# EAGLE design TMC2660-test-with-grbl (EAGLE 7.5.0)

## Sheet 1 of 4
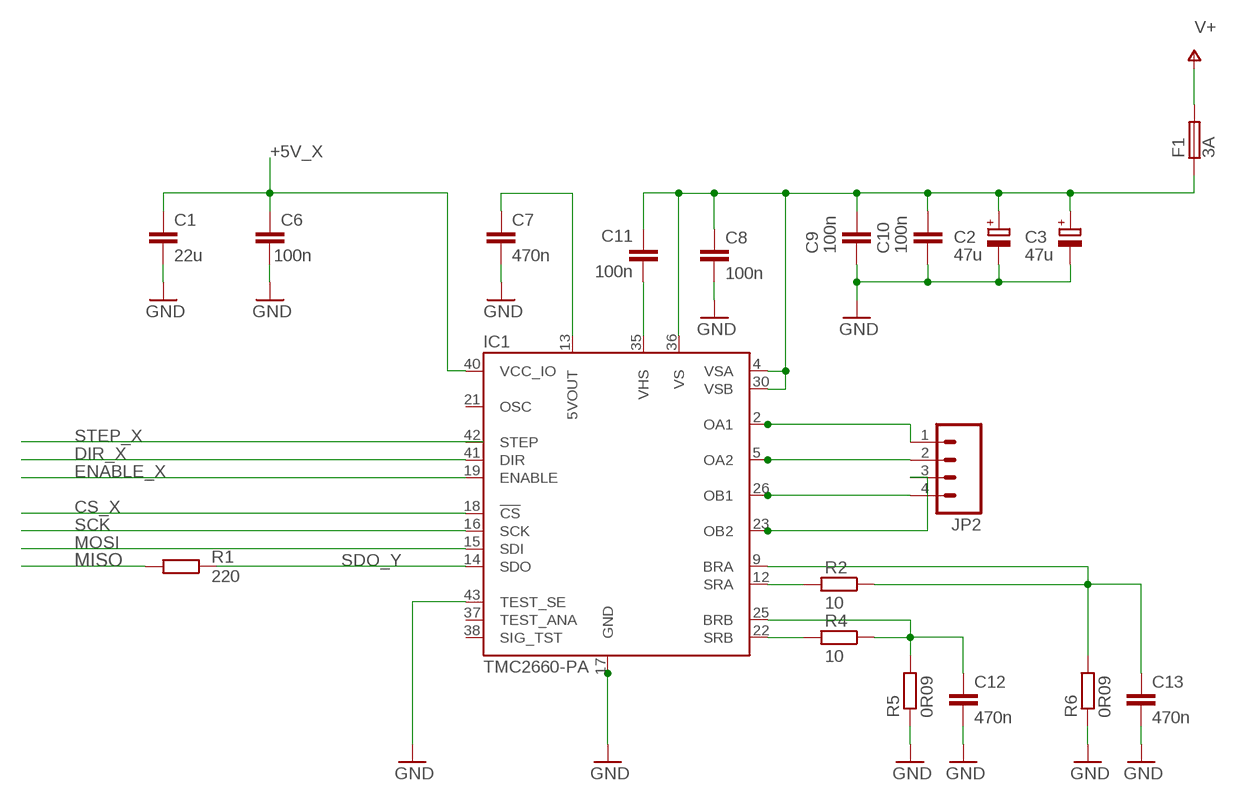
[diagram p0: schematic, sheet 1]

### Parts
C1  22u  C-EUC1206  [C1206]
C2  47u  CPOL-EUE5-8.5  [E5-8,5]
C3  47u  CPOL-EUE5-8.5  [E5-8,5]
C6  100n  C-EUC1206K  [C1206K]
C7  470n  C-0805W  [0805-WIDE]
C8  100n  C-EUC0603K  [C0603K]
C9  100n  C-EUC0603K  [C0603K]
C10  100n  C-EUC0603K  [C0603K]
C11  100n  C-EUC0603K  [C0603K]
C12  470n  C-0805W  [0805-WIDE]
C13  470n  C-0805W  [0805-WIDE]
F1  3A  AF2-FUSE_AF  [AF2]
IC1  TMC2660-PA  [PQFP44]
JP2  M04SCREW  [SCREWTERMINAL-3.5MM-4]
R1  220  R-EU_R0603  [R0603]
R2  10  R-EU_R0603  [R0603]
R4  10  R-EU_R0603  [R0603]
R5  0R09  R-EU_R2512  [R2512]
R6  0R09  R-EU_R2512  [R2512]

### Nets
+5V_X: C1.1 C6.2 IC1.40(VCC_IO)
CS_X: IC1.18(!CS) ; also sheet 4
DIR_X: IC1.41(DIR) ; also sheet 4
ENABLE_X: IC1.19(ENABLE) ; also sheet 4
GND: C1.2 C2.- C3.- C6.1 C7.2 C8.2 C9.1 C10.1 C12.2 C13.2 IC1.17(GND) IC1.39(GND1) IC1.43(TEST_SE) IC1.44(GND2) R5.1 R6.1 ; also sheet 2,3,4
MISO: R1.2 ; also sheet 2,3,4
MOSI: IC1.15(SDI) ; also sheet 2,3,4
N$1: IC1.22(SRB) R4.2
N$2: C12.1 IC1.25(BRB) R4.1 R5.2
N$3: C13.1 IC1.9(BRA) R2.1 R6.2
N$4: IC1.12(SRA) R2.2
OA1: IC1.2(OA1) IC1.3(OA1_1) IC1.7(OA1_2) IC1.8(OA1_3) JP2.1
OA2: IC1.5(OA2) IC1.6(OA2_1) IC1.10(OA2_2) IC1.11(OA2_3) JP2.2
OB1: IC1.26(OB1) IC1.27(OB1_1) IC1.31(OB1_2) IC1.32(OB1_3) JP2.4
OB2: IC1.23(OB2) IC1.24(OB2_1) IC1.28(OB2_2) IC1.29(OB2_3) JP2.3
PWR_X: C2.+ C3.+ C8.1 C9.2 C10.2 C11.2 F1.P$1 IC1.4(VSA) IC1.30(VSB) IC1.36(VS)
SCK: IC1.16(SCK) ; also sheet 2,3,4
SDO_Y: IC1.14(SDO) R1.1
STEP_X: IC1.42(STEP) ; also sheet 4
V+: F1.P$2 ; also sheet 2,3
VHS: C11.1 IC1.35(VHS)
VREG: C7.1 IC1.13(5VOUT)
Unconnected: IC1.21(OSC) IC1.37(TEST_ANA) IC1.38(SIG_TST)

## Sheet 2 of 4
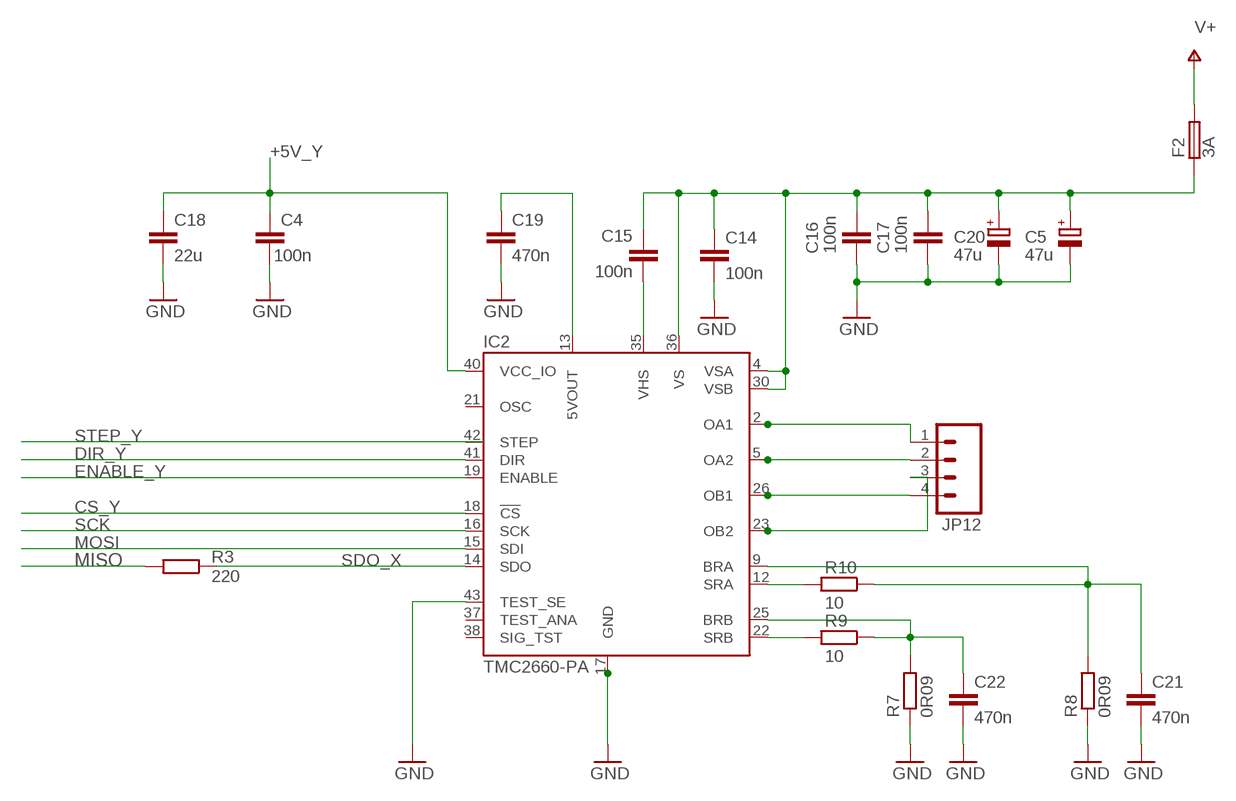
[diagram p1: schematic, sheet 2]

### Parts
C4  100n  C-EUC1206K  [C1206K]
C5  47u  CPOL-EUE5-8.5  [E5-8,5]
C14  100n  C-EUC0603K  [C0603K]
C15  100n  C-EUC0603K  [C0603K]
C16  100n  C-EUC0603K  [C0603K]
C17  100n  C-EUC0603K  [C0603K]
C18  22u  C-EUC1206  [C1206]
C19  470n  C-0805W  [0805-WIDE]
C20  47u  CPOL-EUE5-8.5  [E5-8,5]
C21  470n  C-0805W  [0805-WIDE]
C22  470n  C-0805W  [0805-WIDE]
F2  3A  AF2-FUSE_AF  [AF2]
IC2  TMC2660-PA  [PQFP44]
JP12  M04SCREW  [SCREWTERMINAL-3.5MM-4]
R3  220  R-EU_R0603  [R0603]
R7  0R09  R-EU_R2512  [R2512]
R8  0R09  R-EU_R2512  [R2512]
R9  10  R-EU_R0603  [R0603]
R10  10  R-EU_R0603  [R0603]

### Nets
+5V_Y: C4.2 C18.1 IC2.40(VCC_IO)
CS_Y: IC2.18(!CS) ; also sheet 4
DIR_Y: IC2.41(DIR) ; also sheet 4
ENABLE_Y: IC2.19(ENABLE) ; also sheet 4
GND: C4.1 C5.- C14.2 C16.1 C17.1 C18.2 C19.2 C20.- C21.2 C22.2 IC2.17(GND) IC2.39(GND1) IC2.43(TEST_SE) IC2.44(GND2) R7.1 R8.1 ; also sheet 1,3,4
MISO: R3.2 ; also sheet 1,3,4
MOSI: IC2.15(SDI) ; also sheet 1,3,4
N$5: C22.1 IC2.25(BRB) R7.2 R9.1
N$6: C21.1 IC2.9(BRA) R8.2 R10.1
N$7: IC2.22(SRB) R9.2
N$8: IC2.12(SRA) R10.2
OA3: IC2.2(OA1) IC2.3(OA1_1) IC2.7(OA1_2) IC2.8(OA1_3) JP12.1
OA4: IC2.5(OA2) IC2.6(OA2_1) IC2.10(OA2_2) IC2.11(OA2_3) JP12.2
OB3: IC2.23(OB2) IC2.24(OB2_1) IC2.28(OB2_2) IC2.29(OB2_3) JP12.3
OB4: IC2.26(OB1) IC2.27(OB1_1) IC2.31(OB1_2) IC2.32(OB1_3) JP12.4
PWR_Y: C5.+ C14.1 C15.2 C16.2 C17.2 C20.+ F2.P$1 IC2.4(VSA) IC2.30(VSB) IC2.36(VS)
SCK: IC2.16(SCK) ; also sheet 1,3,4
SDO_X: IC2.14(SDO) R3.1
STEP_Y: IC2.42(STEP) ; also sheet 4
V+: F2.P$2 ; also sheet 1,3
VHS1: C15.1 IC2.35(VHS)
VREG1: C19.1 IC2.13(5VOUT)
Unconnected: IC2.21(OSC) IC2.37(TEST_ANA) IC2.38(SIG_TST)

## Sheet 3 of 4
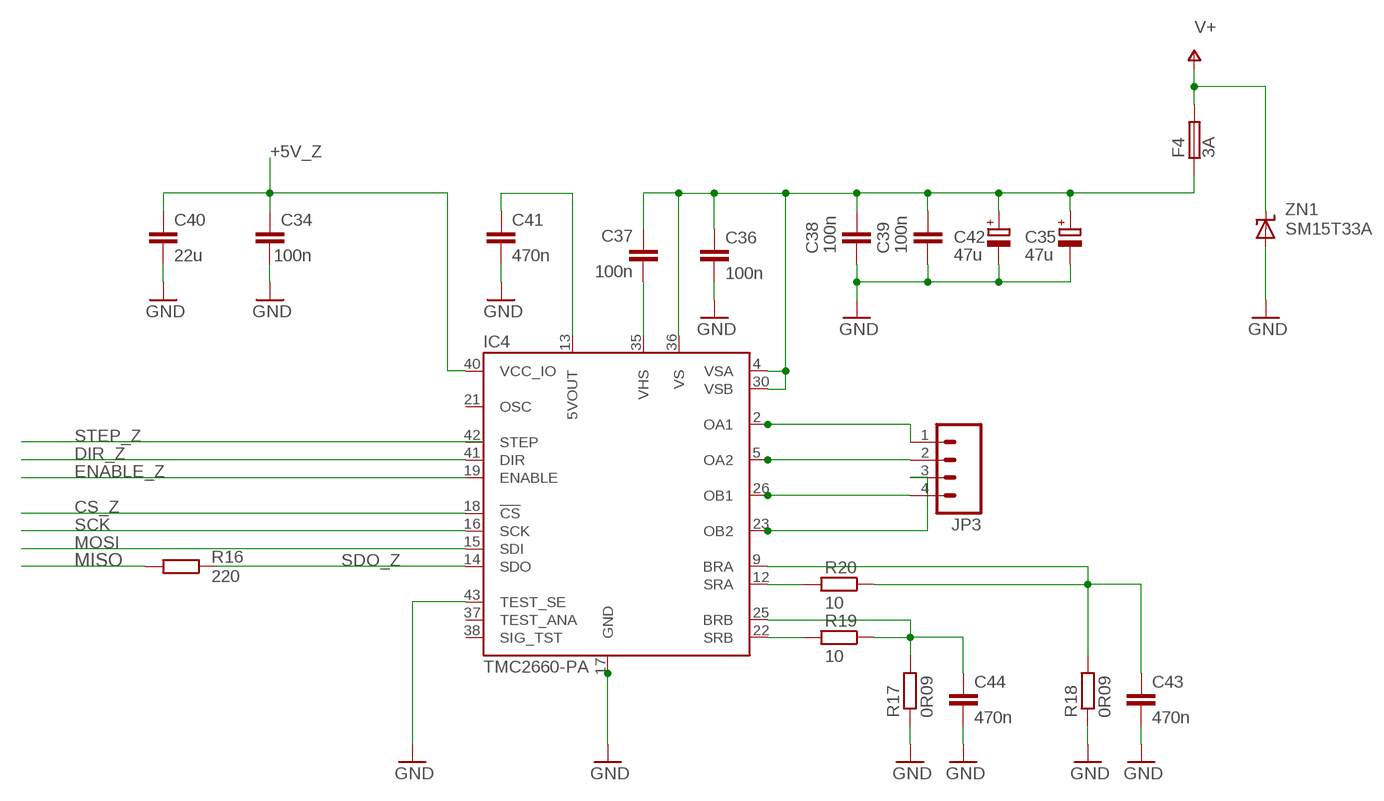
[diagram p2: schematic, sheet 3]

### Parts
C34  100n  C-EUC1206K  [C1206K]
C35  47u  CPOL-EUE5-8.5  [E5-8,5]
C36  100n  C-EUC0603K  [C0603K]
C37  100n  C-EUC0603K  [C0603K]
C38  100n  C-EUC0603K  [C0603K]
C39  100n  C-EUC0603K  [C0603K]
C40  22u  C-EUC1206  [C1206]
C41  470n  C-0805W  [0805-WIDE]
C42  47u  CPOL-EUE5-8.5  [E5-8,5]
C43  470n  C-0805W  [0805-WIDE]
C44  470n  C-0805W  [0805-WIDE]
F4  3A  AF2-FUSE_AF  [AF2]
IC4  TMC2660-PA  [PQFP44]
JP3  M04SCREW  [SCREWTERMINAL-3.5MM-4]
R16  220  R-EU_R0603  [R0603]
R17  0R09  R-EU_R2512  [R2512]
R18  0R09  R-EU_R2512  [R2512]
R19  10  R-EU_R0603  [R0603]
R20  10  R-EU_R0603  [R0603]
ZN1  SM15T33A  D-ZN_SMC  [SMC]

### Nets
+5V_Z: C34.2 C40.1 IC4.40(VCC_IO)
CS_Z: IC4.18(!CS) ; also sheet 4
DIR_Z: IC4.41(DIR) ; also sheet 4
ENABLE_Z: IC4.19(ENABLE) ; also sheet 4
GND: C34.1 C35.- C36.2 C38.1 C39.1 C40.2 C41.2 C42.- C43.2 C44.2 IC4.17(GND) IC4.39(GND1) IC4.43(TEST_SE) IC4.44(GND2) R17.1 R18.1 ZN1.P$2(A) ; also sheet 1,2,4
MISO: R16.2 ; also sheet 1,2,4
MOSI: IC4.15(SDI) ; also sheet 1,2,4
N$9: C44.1 IC4.25(BRB) R17.2 R19.1
N$10: C43.1 IC4.9(BRA) R18.2 R20.1
N$11: IC4.22(SRB) R19.2
N$12: IC4.12(SRA) R20.2
OA5: IC4.2(OA1) IC4.3(OA1_1) IC4.7(OA1_2) IC4.8(OA1_3) JP3.1
OA6: IC4.5(OA2) IC4.6(OA2_1) IC4.10(OA2_2) IC4.11(OA2_3) JP3.2
OB5: IC4.23(OB2) IC4.24(OB2_1) IC4.28(OB2_2) IC4.29(OB2_3) JP3.3
OB6: IC4.26(OB1) IC4.27(OB1_1) IC4.31(OB1_2) IC4.32(OB1_3) JP3.4
PWR_Z: C35.+ C36.1 C37.2 C38.2 C39.2 C42.+ F4.P$1 IC4.4(VSA) IC4.30(VSB) IC4.36(VS)
SCK: IC4.16(SCK) ; also sheet 1,2,4
SDO_Z: IC4.14(SDO) R16.1
STEP_Z: IC4.42(STEP) ; also sheet 4
V+: F4.P$2 ZN1.P$1(C) ; also sheet 1,2
VHS2: C37.1 IC4.35(VHS)
VREG2: C41.1 IC4.13(5VOUT)
Unconnected: IC4.21(OSC) IC4.37(TEST_ANA) IC4.38(SIG_TST)

## Sheet 4 of 4
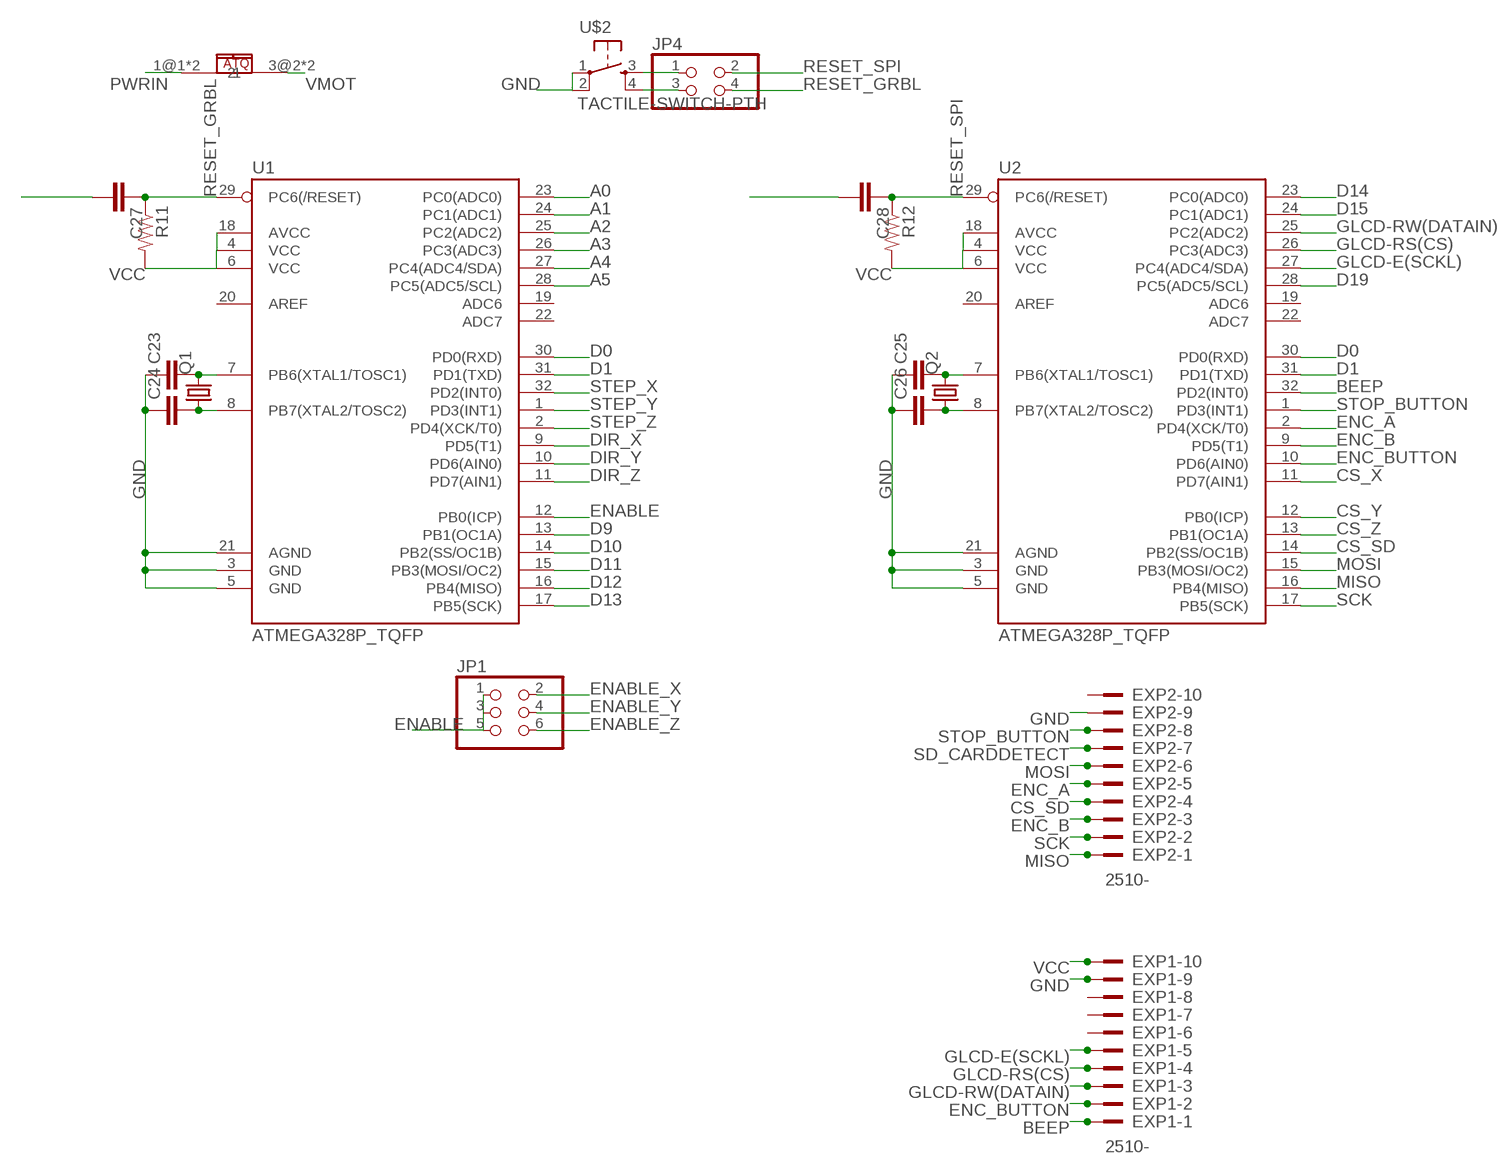
[diagram p3: schematic, sheet 4]

### Parts
C23  CAP1206  [1206]
C24  CAP1206  [1206]
C25  CAP1206  [1206]
C26  CAP1206  [1206]
C27  CAP1206  [1206]
C28  CAP1206  [1206]
EXP1  2510-  [PAK100/2500-10]
EXP2  2510-  [PAK100/2500-10]
JP1  PINHD-2X3  [2X03]
JP4  PINHD-2X2  [2X02]
Q1  CRYSTALHC49UP  [HC49UP]
Q2  CRYSTALHC49UP  [HC49UP]
R11  RESISTOR1206  [1206]
R12  RESISTOR1206  [1206]
U1  ATMEGA328P_TQFP  [TQFP32-08]
U2  ATMEGA328P_TQFP  [TQFP32-08]
U$2  TACTILE-SWITCH-PTH  [TAC-SWITCH-PTH]
U$6  CQ-121  [CQ121]

### Nets
A0: U1.23(PC0(ADC0))
A1: U1.24(PC1(ADC1))
A2: U1.25(PC2(ADC2))
A3: U1.26(PC3(ADC3))
A4: U1.27(PC4(ADC4/SDA))
A5: U1.28(PC5(ADC5/SCL))
BEEP: EXP1.1 U2.32(PD2(INT0))
CS_SD: EXP2.4 U2.14(PB2(SS/OC1B))
CS_X: U2.11(PD7(AIN1)) ; also sheet 1
CS_Y: U2.12(PB0(ICP)) ; also sheet 2
CS_Z: U2.13(PB1(OC1A)) ; also sheet 3
D0: U1.30(PD0(RXD)) U2.30(PD0(RXD))
D1: U1.31(PD1(TXD)) U2.31(PD1(TXD))
D9: U1.13(PB1(OC1A))
D10: U1.14(PB2(SS/OC1B))
D11: U1.15(PB3(MOSI/OC2))
D12: U1.16(PB4(MISO))
D13: U1.17(PB5(SCK))
D14: U2.23(PC0(ADC0))
D15: U2.24(PC1(ADC1))
D19: U2.28(PC5(ADC5/SCL))
DIR_X: U1.9(PD5(T1)) ; also sheet 1
DIR_Y: U1.10(PD6(AIN0)) ; also sheet 2
DIR_Z: U1.11(PD7(AIN1)) ; also sheet 3
DTR_GRBL: C27.2
DTR_SPI: C28.2
ENABLE: JP1.1 JP1.3 JP1.5 U1.12(PB0(ICP))
ENABLE_X: JP1.2 ; also sheet 1
ENABLE_Y: JP1.4 ; also sheet 2
ENABLE_Z: JP1.6 ; also sheet 3
ENC_A: EXP2.5 U2.2(PD4(XCK/T0))
ENC_B: EXP2.3 U2.9(PD5(T1))
ENC_BUTTON: EXP1.2 U2.10(PD6(AIN0))
GLCD-E(SCKL): EXP1.5 U2.27(PC4(ADC4/SDA))
GLCD-RS(CS): EXP1.4 U2.26(PC3(ADC3))
GLCD-RW(DATAIN): EXP1.3 U2.25(PC2(ADC2))
GND: C23.1 C24.1 C25.1 C26.1 EXP1.9 EXP2.9 U1.3(GND) U1.5(GND) U1.21(AGND) U2.3(GND) U2.5(GND) U2.21(AGND) U$2.1 U$2.2 ; also sheet 1,2,3
MISO: EXP2.1 U2.16(PB4(MISO)) ; also sheet 1,2,3
MOSI: EXP2.6 U2.15(PB3(MOSI/OC2)) ; also sheet 1,2,3
N$13: C23.2 Q1.2 U1.7(PB6(XTAL1/TOSC1))
N$14: C24.2 Q1.1 U1.8(PB7(XTAL2/TOSC2))
N$15: C25.2 Q2.2 U2.7(PB6(XTAL1/TOSC1))
N$16: C26.2 Q2.1 U2.8(PB7(XTAL2/TOSC2))
PWRIN: U$6.1@1 U$6.2@1
RESET: JP4.1 JP4.3 U$2.3 U$2.4
RESET_GRBL: C27.1 JP4.4 R11.1 U1.29(PC6(/RESET))
RESET_SPI: C28.1 JP4.2 R12.1 U2.29(PC6(/RESET))
SCK: EXP2.2 U2.17(PB5(SCK)) ; also sheet 1,2,3
SD_CARDDETECT: EXP2.7
STEP_X: U1.32(PD2(INT0)) ; also sheet 1
STEP_Y: U1.1(PD3(INT1)) ; also sheet 2
STEP_Z: U1.2(PD4(XCK/T0)) ; also sheet 3
STOP_BUTTON: EXP2.8 U2.1(PD3(INT1))
VCC: EXP1.10 R11.2 R12.2 U1.4(VCC) U1.6(VCC) U1.18(AVCC) U2.4(VCC) U2.6(VCC) U2.18(AVCC)
VMOT: U$6.3@2 U$6.4@2
Unconnected: EXP1.6 EXP1.7 EXP1.8 EXP2.10 U1.19(ADC6) U1.20(AREF) U1.22(ADC7) U2.19(ADC6) U2.20(AREF) U2.22(ADC7)

## Library data of the parts
C1 C18 C40 = rcl:C-EU: CAPACITOR, European symbol; MANUFACTURER: Taiyo Yuden; PARTNR: JMK316B7226ML-T; TYPE: X7R; VOLTAGE: 6.3V
C2 C3 C5 C20 C35 C42 = rcl:CPOL-EU: POLARIZED CAPACITOR, European symbol; MANUFACTURER: PANASONIC; PARTNR: EEEFK1H470XP; VOLTAGE: 50V
C4 C6 C34 = rcl:C-EU: CAPACITOR, European symbol; MANUFACTURER: Kemet; PARTNR: C0603C104K3RACTU; TYPE: X7R; VOLTAGE: 25V
C7 C12 C13 C19 C21 C22 C41 C43 C44 = 07_eigene_RLC:C; MANUFACTURER: Vishay; PARTNR: VJ0805Y474KXQTW1BC; TYPE: X7R; VOLTAGE: 10V
C8-C11 C14-C17 C36-C39 = rcl:C-EU: CAPACITOR, European symbol; MANUFACTURER: Kemet; PARTNR: C0603C104K5RACTU; TYPE: X7R; VOLTAGE: 50V
C23-C28 = SparkFun-Capacitors:CAP: Capacitor Standard 0603 ceramic capacitor, and 0.1" leaded capacitor.
EXP1 EXP2 = con-3m:2510-: 3M (TM) Pak 100 4-Wall Header Source: 3M; MF: 3M; MPN: 2510-6002UB; OC_FARNELL: 9838244; OC_NEWARK: 46F4725
F1 F2 F4 = 02_eigene:AF2-FUSE: AF2 Very Fast Acting Surface Mount Fuses Konrad Meyer (c) 2011 Very fast acting at 200% overload current levels ? Excellent inrush current withstanding capability ? Fiberglass enforced epoxy fuse body ? Copper or copper alloy composite fuse link ? Copper termination with nickel and tin plating ? Halogen free, RoHS compliant and 100% lead-free ? Operating temperature range: -55°C to +125 °C (with de-rating) www.aem-usa.com; MANUFACTURER: Cooper Bussman; PARTNR: CB61F3A-TR2; VOLTAGE: 125V
IC1 IC2 IC4 = 001_ICs:TMC2660: Stepper Driver TMC2660; MANUFACTURER: TRINAMIC; PARTNR: TMC2660
JP1 = pinhead:PINHD-2X3: PIN HEADER
JP2 JP3 JP12 = SparkFun-Connectors:M04: Header 4 Standard 4-pin 0.1" header. Use with straight break away headers (SKU : PRT-00116), right angle break away headers (PRT-00553), swiss pins (PRT-00743), machine pins (PRT-00117), and female headers (PRT-00115). Molex polarized connector foot print use with SKU : PRT-08231 with associated crimp pins and housings. 1MM SMD Version SKU: PRT-10208
JP4 = pinhead:PINHD-2X2: PIN HEADER
Q1 Q2 = adafruit:CRYSTAL: CRYSTAL; OC_FARNELL: unknown; OC_NEWARK: unknown
R1 R3 R16 = rcl:R-EU_: RESISTOR, European symbol; MANUFACTURER: KOA Speer; PARTNR: SG73S1JTTD221J
R2 R4 R9 R10 R19 R20 = rcl:R-EU_: RESISTOR, European symbol; MANUFACTURER: KOA Speer; PARTNR: RN73H1JTTD10R0F100
R5-R8 R17 R18 = rcl:R-EU_: RESISTOR, European symbol; MANUFACTURER: Panasonic; PARTNR: ERJ-B2CFR091V; POWER: 0.75W
R11 R12 = SparkFun-Passives:RESISTOR: Resistor Basic schematic elements and footprints for 0603, 1206, and PTH resistors.
U1 U2 = SparkFun-DigitalIC:ATMEGA328P_TQFP; PROD_ID: IC-09069
U$2 = GeekAmmo:TACTILE-SWITCH: Tactile Switch 4 Pins, SPST NO
U$6 = Mantech.co.za:CQ-121
ZN1 = 08_Diskret:D-ZN: SM15T - Transil(TM) refer to datasheet for e.g. SM15T36A; MANUFACTURER: ST; PARTNR: SM15T33A; PLACED: NO

## Board
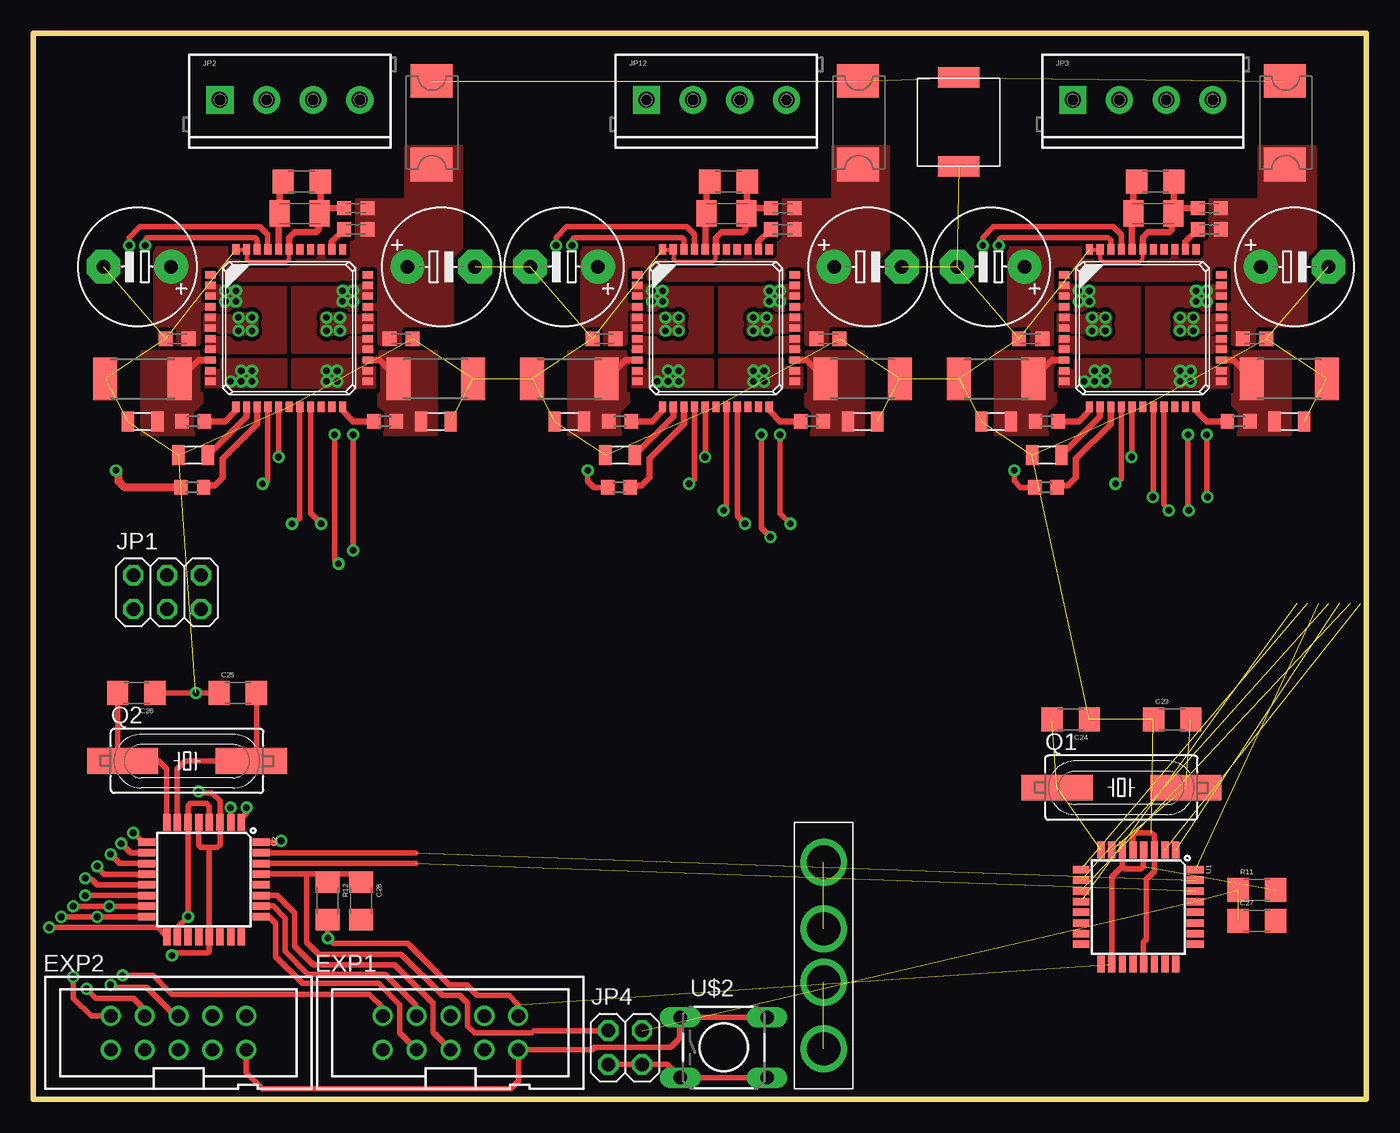
[diagram p4: board, top side]
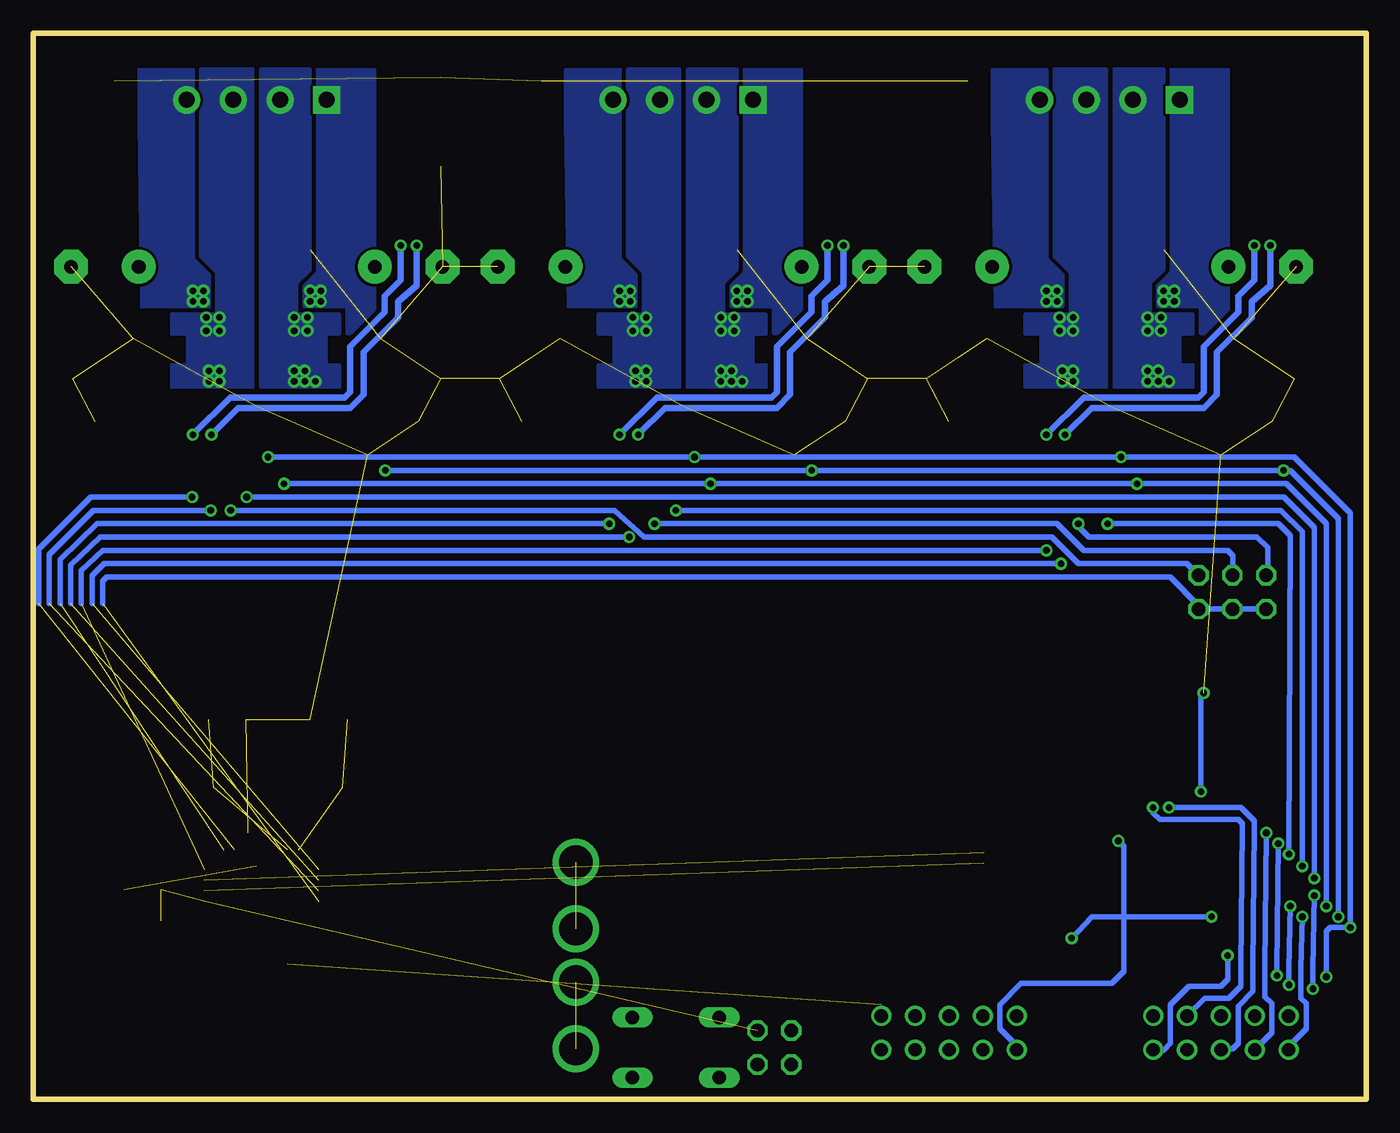
[diagram p5: board, bottom side, seen from below]

Size 100 x 80 mm. Coordinates in mm from the lower left corner, seen from the top.
Outline: 0,0 0,80 100,80 100,0 0,0
Copper layers (1*16): Top 0.035mm / dielectric 1.5mm / Bottom 0.035mm
Design rules "default": minimum track width 10mil, minimum drill 24mil, track to track 8mil, track to pad 8mil, pad to pad 8mil, via to via 8mil, smd to smd 8mil, copper to edge 40mil, drill to drill 8mil, minimum pad ring 10mil, minimum via ring 8mil, stop-mask expansion 4mil, vias tented up to drill 0mil, thermal gap 10mil

### Footprints (pad centres in the part's own frame; a part is rotated, then mirrored left to right if it is on the bottom)
C1206 = smd 1.6 x 1.8: 1 -1.4,0; 2 1.4,0
E5-8,5 = drill 1.016 pad 2.54: + -2.54,0 | drill 1.016 pad 2.54 octagon: - 2.54,0
C1206K = smd 1.5 x 2: 1 -1.5,0; 2 1.5,0
0805-WIDE = smd 0.919 x 1.5: 1 -1.104,0; 2 1.104,0
C0603K = smd 1.05 x 1.08: 1 -0.875,0; 2 0.875,0
1206 = smd 1.6 x 1.8: 1 -1.4,0; 2 1.4,0
PAK100/2500-10 = drill 1 pad 1.422: 1 -5.08,-1.27; 2 -5.08,1.27; 3 -2.54,-1.27; 4 -2.54,1.27; 5 0,-1.27; 6 0,1.27; 7 2.54,-1.27; 8 2.54,1.27; 9 5.08,-1.27; 10 5.08,1.27
AF2 = smd 2.54 x 3.15: P$1 -3.132,0; P$2 3.132,0
PQFP44 = smd 0.54 x 0.8: 1 -4,-5.9; 2 -3.2,-5.9; 3 -2.4,-5.9; 4 -1.6,-5.9; 5 -0.8,-5.9; 6 0,-5.9; 7 0.8,-5.9; 8 1.6,-5.9; 9 2.4,-5.9; 10 3.2,-5.9; 11 4,-5.9; 23 4,5.9; 24 3.2,5.9; 25 2.4,5.9; 26 1.6,5.9; 27 0.8,5.9; 28 0,5.9; 29 -0.8,5.9; 30 -1.6,5.9; 31 -2.4,5.9; 32 -3.2,5.9; 33 -4,5.9 | smd 0.8 x 0.54: 12 5.9,-4; 13 5.9,-3.2; 14 5.9,-2.4; 15 5.9,-1.6; 16 5.9,-0.8; 17 5.9,0; 18 5.9,0.8; 19 5.9,1.6; 20 5.9,2.4; 21 5.9,3.2; 22 5.9,4; 34 -5.9,4; 35 -5.9,3.2; 36 -5.9,2.4; 37 -5.9,1.6; 38 -5.9,0.8; 39 -5.9,0; 40 -5.9,-0.8; 41 -5.9,-1.6; 42 -5.9,-2.4; 43 -5.9,-3.2; 44 -5.9,-4
2X03 = drill 1.016 octagon: 1 -2.54,-1.27; 2 -2.54,1.27; 3 0,-1.27; 4 0,1.27; 5 2.54,-1.27; 6 2.54,1.27
SCREWTERMINAL-3.5MM-4 = drill 1.2 pad 2.032 square: 1 0,0 | drill 1.2 pad 2.032: 2 3.5,0; 3 7,0; 4 10.5,0
2X02 = drill 1.016 octagon: 1 -1.27,-1.27; 2 -1.27,1.27; 3 1.27,-1.27; 4 1.27,1.27
HC49UP = smd 5.334 x 1.93: 1 -4.826,0; 2 4.826,0
R0603 = smd 1 x 1.1: 1 -0.85,0; 2 0.85,0
R2512 = smd 1.8 x 3.2: 1 -2.8,0; 2 2.8,0
TQFP32-08 = smd 1.27 x 0.559: 1 -4.293,2.8; 2 -4.293,2; 3 -4.293,1.2; 4 -4.293,0.4; 5 -4.293,-0.4; 6 -4.293,-1.2; 7 -4.293,-2; 8 -4.293,-2.8; 17 4.293,-2.8; 18 4.293,-2; 19 4.293,-1.2; 20 4.293,-0.4; 21 4.293,0.4; 22 4.293,1.2; 23 4.293,2; 24 4.293,2.8 | smd 0.559 x 1.27: 9 -2.8,-4.293; 10 -2,-4.293; 11 -1.2,-4.293; 12 -0.4,-4.293; 13 0.4,-4.293; 14 1.2,-4.293; 15 2,-4.293; 16 2.8,-4.293; 25 2.8,4.293; 26 2,4.293; 27 1.2,4.293; 28 0.4,4.293; 29 -0.4,4.293; 30 -1.2,4.293; 31 -2,4.293; 32 -2.8,4.293
TAC-SWITCH-PTH = drill 1.016 pad 1.524 long: 1 -3.251,2.261; 2 3.251,2.261; 3 -3.251,-2.261; 4 3.251,-2.261
CQ121 = drill 2.5: 1@1 -7,0; 2@1 -2,0; 3@2 2,0; 4@2 7,0
SMC = smd 1.54 x 3.14: P$1 -3.33,0; P$2 3.33,0

### Placement (x,y rotation side)
C1  20.14,68.88 0 top
C2  30.6,62.48 0 top
C3  7.8,62.48 180 top
C4  52.02,66.48 180 top
C5  39.82,62.48 180 top
C6  20,66.48 180 top
C7  12,48.35 180 top
C8  10.8,57.08 180 top
C9  27.6,57.08 180 top
C10  24.2,66.88 0 top
C11  24.2,65.28 0 top
C12  30.2,50.88 0 top
C13  8.2,50.88 180 top
C14  42.82,57.08 180 top
C15  56.22,65.28 0 top
C16  59.62,57.08 180 top
C17  56.22,66.88 0 top
C18  52.16,68.88 0 top
C19  44.02,48.35 180 top
C20  62.62,62.48 0 top
C21  40.22,50.88 180 top
C22  62.22,50.88 0 top
C23  85.45,28.5 0 top
C24  77.83,28.5 180 top
C25  15.35,30.5 0 top
C26  7.73,30.5 180 top
C27  91.8,13.4 0 top
C28  24.6,14.9 270 top
C34  84.04,66.48 180 top
C35  71.84,62.48 180 top
C36  74.84,57.08 180 top
C37  88.24,65.28 0 top
C38  91.64,57.08 180 top
C39  88.24,66.88 0 top
C40  84.18,68.88 0 top
C41  76.04,48.35 180 top
C42  94.64,62.48 0 top
C43  72.24,50.88 180 top
C44  94.24,50.88 0 top
EXP1  31.3,5 0 top
EXP2  10.9,5 0 top
F1  29.87,73.29 90 top
F2  61.89,73.29 90 top
F4  93.91,73.29 90 top
IC1  19.2,57.88 270 top
IC2  51.22,57.88 270 top
IC4  83.24,57.88 270 top
JP1  10.04,38.07 0 top
JP2  14,75 0 top
JP3  78,75 0 top
JP4  44.4,3.9 0 top
JP12  46,75 0 top
Q1  81.64,23.4 0 top
Q2  11.54,25.4 0 top
R1  11.93,45.93 180 top
R2  12,50.88 0 top
R3  43.95,45.93 180 top
R4  26.4,50.88 180 top
R5  30.2,54.08 180 top
R6  8.2,54.08 0 top
R7  62.22,54.08 180 top
R8  40.22,54.08 0 top
R9  58.42,50.88 180 top
R10  44.02,50.88 0 top
R11  91.8,15.72 0 top
R12  22.08,14.9 270 top
R16  75.97,45.93 180 top
R17  94.24,54.08 180 top
R18  72.24,54.08 0 top
R19  90.44,50.88 180 top
R20  76.04,50.88 0 top
U1  82.91,14.45 270 top
U2  12.81,16.51 270 top
U$2  51.8,3.9 0 top
U$6  59.3,10.8 90 top
ZN1  69.43,73.35 270 top

### Tracks (layer width: path | path; a pad name or v marks a point on that pad's centre or on a via)
+5V_X
  Top 0.5: IC1.40 18.4,66.38 C6.2 18.5,68.64 C1.1
+5V_Y
  Top 0.5: IC2.40 50.42,66.38 C4.2 50.52,68.64 C18.1
+5V_Z
  Top 0.5: IC4.40 82.44,66.38 C34.2 82.54,68.64 C40.1
BEEP  (via drill 0.5 pad 0.25)
  Top 0.406: v18.6,19.4 18.5,19.3 17.11,19.3 U2.32
  Bottom 0.406: EXP1.1 26.22,4.02 27.5,5.3 27.5,7.1 25.9,8.7 19.1,8.7 18.2,9.6 18.2,19 v18.6,19.4
CS_SD  (via drill 0.5 pad 0.25)
  Top 0.406: U2.14 v3.91,15.31 v3.9,15.3 | EXP2.4 8.36,6.74 7.5,7.6 4.7,7.6 v4,8.3
  Bottom 0.406: v3.9,15.3 4,9.8 v4,8.3
CS_X  (via drill 0.5 pad 0.25)
  Top 0.406: IC1.18 20,43.6 v19.4,43.2 | v5.8,18.4 6.5,17.7 8.51,17.7 U2.11
  Bottom 0.406: v19.4,43.2 6.6,43.2 5.7,42.3 v5.8,18.4
CS_Y  (via drill 0.5 pad 0.25)
  Top 0.406: IC2.18 52.02,44.62 v51.8,44.2 | v4.8,17.5 5.3,16.9 8.51,16.9 U2.12
  Bottom 0.406: v51.8,44.2 6.4,44.2 4.8,42.6 v4.8,17.5
CS_Z  (via drill 0.5 pad 0.25)
  Top 0.406: IC4.18 84.04,45.24 v84,45.2 | 8.61,16.1 U2.13 8.51,16.1 4.8,16.1 4.4,16.5 v3.9,16.6
  Bottom 0.406: v84,45.2 6.2,45.2 3.9,42.9 v3.9,16.6
D0  (1 unrouted)
  Top 0.406: U2.30 28.7,17.71 28.7,17.7
D1  (1 unrouted)
  Top 0.406: U2.31 28.7,18.51 28.7,18.5
DIR_X  (via drill 0.5 pad 0.25)  (1 unrouted)
  Top 0.406: IC1.41 17.6,64.88 17,65.48 8,65.48 7.2,64.68 v7.2,64.08 | v22.6,49.88 22.6,40.5 v22.9,40.2
  Bottom 0.406: v22.9,40.2 94.7,40.2 95.6,39.3 95.6,37.2
  Bottom 0.5: v22.6,49.88 20.6,51.88 12.2,51.88 11.2,52.88 11.2,56.08 8.6,58.68 8.6,59.88 7.2,61.08 v7.2,64.08
DIR_Y  (via drill 0.5 pad 0.25)  (1 unrouted)
  Top 0.406: IC2.41 49.62,64.88 49.02,65.48 40.02,65.48 39.22,64.68 v39.22,64.08 | v54.62,49.88 54.62,42.88 v55.3,42.2
  Bottom 0.406: v55.3,42.2 95,42.2 97.2,40.1 97.2,37.2
  Bottom 0.5: v54.62,49.88 52.62,51.88 44.22,51.88 43.22,52.88 43.22,56.08 40.62,58.68 40.62,59.88 39.22,61.08 v39.22,64.08
DIR_Z  (via drill 0.5 pad 0.25)  (1 unrouted)
  Top 0.406: IC4.41 81.64,64.88 81.04,65.48 72.04,65.48 71.24,64.68 v71.24,64.08 | v86.64,49.88 86.64,44.26 v86.7,44.2
  Bottom 0.406: v86.7,44.2 95.5,44.2 98.8,40.9 98.8,37.2
  Bottom 0.5: v86.64,49.88 84.64,51.88 76.24,51.88 75.24,52.88 75.24,56.08 72.64,58.68 72.64,59.88 71.24,61.08 v71.24,64.08
ENABLE  (1 unrouted)
  Bottom 0.406: 94.8,37.2 94.8,38.9 94.5,39.2 14.7,39.2 12.58,37.08 JP1.5 JP1.3 JP1.1
ENABLE_X  (via drill 0.5 pad 0.25)
  Top 0.406: IC1.19 20.8,44 v21.6,43.2
  Bottom 0.406: v21.6,43.2 21.4,43.2 21.4,42.8 20.8,42.2 8.2,42.2 7.4,41.4 7.4,39.44 JP1.2
ENABLE_Y  (via drill 0.5 pad 0.25)
  Top 0.406: IC2.19 52.82,43.78 v53.4,43.2
  Bottom 0.406: v53.4,43.2 23.2,43.2 21.2,41.2 10.4,41.2 10,40.8 10,39.38 JP1.4
ENABLE_Z  (via drill 0.5 pad 0.25)
  Top 0.406: IC4.19 84.84,44.64 v85.2,44.2
  Bottom 0.406: v85.2,44.2 56.4,44.2 54.2,42.2 23.6,42.2 21.6,40.2 13.44,40.2 JP1.6
ENC_A  (via drill 0.5 pad 0.25)
  Top 0.406: v14.8,21.9 14.8,20.81 U2.2
  Bottom 0.406: v14.8,21.9 9.4,21.9 8.4,20.9 8.4,20.4 8.5,9.8 8.5,8.1 9.6,7 9.6,4.2 10,3.8 10.83,3.8 EXP2.5
ENC_B  (via drill 0.5 pad 0.25)
  Top 0.406: 8.51,19.3 U2.9 8.19,19.31 v7.5,20
  Bottom 0.406: v7.5,20 7.6,9.8 7.6,7.7 7.1,7.2 7.1,4.99 EXP2.3
ENC_BUTTON  (via drill 0.5 pad 0.25)
  Top 0.406: v6.6,19.2 7.3,18.5 8.51,18.5 U2.10 | v6.7,9.3 9,9.3 10.4,7.9 25.2,7.9 26.2,6.9 26.2,6.29 EXP1.2
  Bottom 0.406: v6.6,19.2 6.7,9.8 v6.7,9.3
GLCD-E(SCKL)
  Top 0.406: U2.27 18.29,15.31 19.6,14 19.6,11.5 21,10.1 27.1,10.1 30,7.2 30,5.03 EXP1.5
GLCD-RS(CS)
  Top 0.406: U2.26 17.99,14.51 18.9,13.6 18.9,11.1 20.6,9.4 26.4,9.4 28.7,7.1 28.7,6.33 EXP1.4
GLCD-RW(DATAIN)
  Top 0.406: U2.25 17.69,13.71 18.2,13.2 18.2,10.7 20.2,8.7 25.9,8.7 27.5,7.1 27.5,4.99 EXP1.3
GND  (via drill 0.5 pad 0.25)  (37 unrouted)
  Top 0.305: IC1.44 IC1.43 16,63.08 16.2,62.88 19,62.88 19.2,63.08 IC1.39 | IC2.44 IC2.43 48.02,63.08 48.22,62.88 51.02,62.88 51.22,63.08 IC2.39 | IC4.44 IC4.43 80.04,63.08 80.24,62.88 83.04,62.88 83.24,63.08 IC4.39
  Top 0.406: C26.1 v12.2,30.5 C25.1 | 13.3,18.9 13.8,18.9 14.01,19.11 U2.3 14.01,22.39 13.4,23 12.5,23 v12.4,23.1 | 13.3,18.9 12.6,18.9 12.4,19.1 U2.5 | 13.3,18.9 13.21,18.81 U2.21 13.21,11.11 13.1,11 10.6,11 v10.4,10.8 | U1.5 82.51,19.81 82.7,20 83.9,20 84.1,19.8 84.1,18.75 U1.3 84.11,17.11 83.5,16.5 83.5,12 83.3,11.8 U1.21 | EXP2.9 15.98,2.02 17.2,0.8 35.8,0.8 36.4,1.4 36.4,3.71 EXP1.9 41.93,3.73 42.1,3.9 47.8,3.9 48.5,4.6 48.5,6.11 U$2.1 U$2.2
  Top 0.5: IC1.39 19.2,64.68 19.6,65.08 21.2,65.08 21.4,65.28 21.4,66.38 C6.1 | C10.1 21.9,66.88 C6.1 | C1.2 21.54,66.52 C6.1 | IC2.39 51.22,64.68 51.62,65.08 53.22,65.08 53.42,65.28 53.42,66.38 C4.1 | C17.1 53.92,66.88 C4.1 | C18.2 53.56,66.52 C4.1 | IC4.39 83.24,64.68 83.64,65.08 85.24,65.08 85.44,65.28 85.44,66.38 C34.1 | C39.1 85.94,66.88 C34.1 | C40.2 85.58,66.52 C34.1
  Bottom 0.406: v12.4,23.1 12.4,30.3 v12.2,30.5 | v10.4,10.8 10.4,9 10.9,8.5 13.3,8.5 14.7,7.1 14.7,4.2 15.2,3.7 15.95,3.7 EXP2.9
MISO  (via drill 0.5 pad 0.25)
  Top 0.406: R3.2 42.07,45.93 41.6,46.4 v41.6,47.2 | R16.2 74.07,45.93 73.6,46.4 v73.6,47.2 | v2.1,13.7 v4.8,13.7 8.41,13.7 U2.16
  Top 0.61: R1.2 6.87,45.93 6.4,46.4 6.4,47 v6.2,47.2
  Bottom 0.406: v73.6,47.2 v41.6,47.2 v6.2,47.2 5.7,47.2 2.1,43.6 v2.1,13.7 2.2,13.6 | v4.8,13.7 4.9,9.8 4.9,7.6 4.5,7.2 4.5,5.3 5.82,3.98 EXP2.1
MOSI  (via drill 0.5 pad 0.25)
  Top 0.406: IC1.15 17.6,46.4 v17.2,46.2 | IC2.15 49.62,46.52 v49.2,46.2 | IC4.15 81.64,46.54 v81.2,46.2 | v3,14.5 v5.7,14.5 8.41,14.5 U2.15 | EXP2.6 10.63,6.27 8.5,8.4 6,8.4 v5.8,8.6
  Bottom 0.406: v81.2,46.2 v49.2,46.2 v17.2,46.2 6,46.2 3,43.2 v3,14.5 | v5.7,14.5 5.8,9.8 v5.8,8.6
N$1
  Top 0.5: IC1.22 23.2,51.68 24,50.88 R4.2
N$2
  Top 0.5: IC1.25 26,55.48 R5.2
  pour Top (isolate 0.305, rank 3, no thermals): 24.4,55.88 25.6,55.88 25.8,56.08 30.2,56.08 30.2,49.88 26.4,49.88 26.4,51.68 26,52.08 26,54.88 25.8,55.08 24.4,55.08
N$3
  Top 0.5: IC1.9 12.4,55.48 R6.2
  pour Top (isolate 0.305, rank 3, no thermals): 8.2,56.08 14,56.08 14,55.08 12.8,55.08 12.6,54.88 12.6,52.28 12,51.68 12,49.88 8.2,49.88
N$4
  Top 0.5: IC1.12 15.2,51.68 14.4,50.88 R2.2
N$5
  Top 0.5: IC2.25 58.02,55.48 R7.2
  pour Top (isolate 0.305, rank 3, no thermals): 56.42,55.88 57.62,55.88 57.82,56.08 62.22,56.08 62.22,49.88 58.42,49.88 58.42,51.68 58.02,52.08 58.02,54.88 57.82,55.08 56.42,55.08
N$6
  Top 0.5: IC2.9 44.42,55.48 R8.2
  pour Top (isolate 0.305, rank 3, no thermals): 40.22,56.08 46.02,56.08 46.02,55.08 44.82,55.08 44.62,54.88 44.62,52.28 44.02,51.68 44.02,49.88 40.22,49.88
N$7
  Top 0.5: IC2.22 55.22,51.68 56.02,50.88 R9.2
N$8
  Top 0.5: IC2.12 47.22,51.68 46.42,50.88 R10.2
N$9
  Top 0.5: IC4.25 90.04,55.48 R17.2
  pour Top (isolate 0.305, rank 3, no thermals): 88.44,55.88 89.64,55.88 89.84,56.08 94.24,56.08 94.24,49.88 90.44,49.88 90.44,51.68 90.04,52.08 90.04,54.88 89.84,55.08 88.44,55.08
N$10
  Top 0.5: IC4.9 76.44,55.48 R18.2
  pour Top (isolate 0.305, rank 3, no thermals): 72.24,56.08 78.04,56.08 78.04,55.08 76.84,55.08 76.64,54.88 76.64,52.28 76.04,51.68 76.04,49.88 72.24,49.88
N$11
  Top 0.5: IC4.22 87.24,51.68 88.04,50.88 R19.2
N$12
  Top 0.5: IC4.12 79.24,51.68 78.44,50.88 R20.2
N$13  (2 unrouted)
N$14  (2 unrouted)
N$15
  Top 0.406: U2.7 10.81,24.81 11.4,25.4 Q2.2 16.75,25.78 C25.2
N$16
  Top 0.406: C26.2 6.33,25.78 Q2.1 9.4,25.4 10.01,24.79 U2.8
OA1  (via drill 0.5 pad 0.25)
  other vias: 14.4,60.68 15.2,60.68 14.4,59.88 15.2,59.88
  pour Top (isolate 0.305, rank 2, no thermals): 12.8,56.08 18.9,56.08 18.9,61.08 12.8,61.08 12.8,60.08 14,60.08 14,59.28 17.2,59.28 17.2,57.08 12.8,57.08
  pour Bottom (rank 2, no thermals): 15.6,59.48 15.6,61.08 14.6,62.08 14.6,77.28 10.4,77.28 10.4,59.28 12.2,57.48 12.4,57.48 12.4,59.48
OA2  (via drill 0.5 pad 0.25)
  other vias: 15.4,58.68 16.4,58.68 16.4,57.68 15.4,57.68 15.6,54.68 16.4,54.68 16.4,53.88 15.6,53.88 14.8,53.88
  pour Bottom (no thermals): 18.9,53.48 13,53.48 13,55.08 14,55.08 14,57.48 13,57.48 13,58.88 16.2,58.88 16.2,61.28 15.2,62.28 15.2,77.28 18.9,77.28
  pour Top (rank 3, no thermals): 12.8,57.48 16.8,57.48 16.8,58.88 12.8,58.88
  pour Top (no thermals): 13,54.68 14.2,54.68 14.2,55.48 18.9,55.48 18.9,53.48 13,53.48
OA3  (via drill 0.5 pad 0.25)
  other vias: 46.42,60.68 47.22,60.68 46.42,59.88 47.22,59.88
  pour Top (isolate 0.305, rank 2, no thermals): 44.82,56.08 50.92,56.08 50.92,61.08 44.82,61.08 44.82,60.08 46.02,60.08 46.02,59.28 49.22,59.28 49.22,57.08 44.82,57.08
  pour Bottom (rank 2, no thermals): 47.62,59.48 47.62,61.08 46.62,62.08 46.62,77.28 42.42,77.28 42.42,59.28 44.22,57.48 44.42,57.48 44.42,59.48
OA4  (via drill 0.5 pad 0.25)
  other vias: 47.42,58.68 48.42,58.68 48.42,57.68 47.42,57.68 47.62,54.68 48.42,54.68 48.42,53.88 47.62,53.88 46.82,53.88
  pour Bottom (no thermals): 50.92,53.48 45.02,53.48 45.02,55.08 46.02,55.08 46.02,57.48 45.02,57.48 45.02,58.88 48.22,58.88 48.22,61.28 47.22,62.28 47.22,77.28 50.92,77.28
  pour Top (rank 3, no thermals): 44.82,57.48 48.82,57.48 48.82,58.88 44.82,58.88
  pour Top (no thermals): 45.02,54.68 46.22,54.68 46.22,55.48 50.92,55.48 50.92,53.48 45.02,53.48
OA5  (via drill 0.5 pad 0.25)
  other vias: 78.44,60.68 79.24,60.68 78.44,59.88 79.24,59.88
  pour Top (isolate 0.305, rank 2, no thermals): 76.84,56.08 82.94,56.08 82.94,61.08 76.84,61.08 76.84,60.08 78.04,60.08 78.04,59.28 81.24,59.28 81.24,57.08 76.84,57.08
  pour Bottom (rank 2, no thermals): 79.64,59.48 79.64,61.08 78.64,62.08 78.64,77.28 74.44,77.28 74.44,59.28 76.24,57.48 76.44,57.48 76.44,59.48
OA6  (via drill 0.5 pad 0.25)
  other vias: 79.44,58.68 80.44,58.68 80.44,57.68 79.44,57.68 79.64,54.68 80.44,54.68 80.44,53.88 79.64,53.88 78.84,53.88
  pour Bottom (no thermals): 82.94,53.48 77.04,53.48 77.04,55.08 78.04,55.08 78.04,57.48 77.04,57.48 77.04,58.88 80.24,58.88 80.24,61.28 79.24,62.28 79.24,77.28 82.94,77.28
  pour Top (rank 3, no thermals): 76.84,57.48 80.84,57.48 80.84,58.88 76.84,58.88
  pour Top (no thermals): 77.04,54.68 78.24,54.68 78.24,55.48 82.94,55.48 82.94,53.48 77.04,53.48
OB1  (via drill 0.5 pad 0.25)
  other vias: 23.2,59.88 24,59.88 23.2,60.68 24,60.68
  pour Top (isolate 0.305, rank 2, no thermals): 19.5,56.08 25.6,56.08 25.6,57.08 21.2,57.08 21.2,59.28 24.4,59.28 24.4,60.08 25.6,60.08 25.6,61.08 19.5,61.08
  pour Bottom (rank 2, no thermals): 22.8,59.48 27.8,59.48 28,73.48 28,77.28 24,77.28 24,63.08 22.8,61.88
OB2  (via drill 0.5 pad 0.25)
  other vias: 22,54.68 22.8,54.68 22,53.88 22.8,53.88 22,57.68 23,57.68 22,58.68 23,58.68
  pour Bottom (no thermals): 19.5,53.48 19.5,77.28 23.4,77.28 23.4,63.28 22.2,62.08 22.2,58.88 25.6,58.88 25.6,57.48 24.4,57.48 24.4,55.08 25.6,55.08 25.6,53.48
  pour Top (no thermals): 25.6,54.88 24.2,54.88 24.2,55.48 19.5,55.48 19.5,53.48 25.6,53.48
  pour Top (rank 3, no thermals): 21.6,57.48 25.6,57.48 25.6,58.88 21.6,58.88
OB3  (via drill 0.5 pad 0.25)
  other vias: 54.02,54.68 54.82,54.68 54.02,53.88 54.82,53.88 54.02,57.68 55.02,57.68 54.02,58.68 55.02,58.68
  pour Bottom (no thermals): 51.52,53.48 51.52,77.28 55.42,77.28 55.42,63.28 54.22,62.08 54.22,58.88 57.62,58.88 57.62,57.48 56.42,57.48 56.42,55.08 57.62,55.08 57.62,53.48
  pour Top (no thermals): 57.62,54.88 56.22,54.88 56.22,55.48 51.52,55.48 51.52,53.48 57.62,53.48
  pour Top (rank 3, no thermals): 53.62,57.48 57.62,57.48 57.62,58.88 53.62,58.88
OB4  (via drill 0.5 pad 0.25)
  other vias: 55.22,59.88 56.02,59.88 55.22,60.68 56.02,60.68
  pour Top (isolate 0.305, rank 2, no thermals): 51.52,56.08 57.62,56.08 57.62,57.08 53.22,57.08 53.22,59.28 56.42,59.28 56.42,60.08 57.62,60.08 57.62,61.08 51.52,61.08
  pour Bottom (rank 2, no thermals): 54.82,59.48 59.82,59.48 60.02,73.48 60.02,77.28 56.02,77.28 56.02,63.08 54.82,61.88
OB5  (via drill 0.5 pad 0.25)
  other vias: 86.04,54.68 86.84,54.68 86.04,53.88 86.84,53.88 86.04,57.68 87.04,57.68 86.04,58.68 87.04,58.68
  pour Bottom (no thermals): 83.54,53.48 83.54,77.28 87.44,77.28 87.44,63.28 86.24,62.08 86.24,58.88 89.64,58.88 89.64,57.48 88.44,57.48 88.44,55.08 89.64,55.08 89.64,53.48
  pour Top (no thermals): 89.64,54.88 88.24,54.88 88.24,55.48 83.54,55.48 83.54,53.48 89.64,53.48
  pour Top (rank 3, no thermals): 85.64,57.48 89.64,57.48 89.64,58.88 85.64,58.88
OB6  (via drill 0.5 pad 0.25)
  other vias: 87.24,59.88 88.04,59.88 87.24,60.68 88.04,60.68
  pour Top (isolate 0.305, rank 2, no thermals): 83.54,56.08 89.64,56.08 89.64,57.08 85.24,57.08 85.24,59.28 88.44,59.28 88.44,60.08 89.64,60.08 89.64,61.08 83.54,61.08
  pour Bottom (rank 2, no thermals): 86.84,59.48 91.84,59.48 92.04,73.48 92.04,77.28 88.04,77.28 88.04,63.08 86.84,61.88
PWR_X
  pour Top (isolate 0.305, no thermals): 12.4,62.48 12.4,59.68 13.6,59.68 13.6,59.28 12.4,59.28 12.4,56.68 10.8,56.68 10.8,58.08 9.2,58.08 9.2,63.88 14.6,63.88 14.6,63.08 21.4,63.08 21.4,64.08 21.8,64.08 21.8,63.08 23.8,63.08 23.8,67.48 28,67.48 28,71.48 32.1,71.48 32.1,63.88 31.4,63.18 31.4,58.08 27.6,58.08 27.6,56.68 26,56.68 26,59.28 24.8,59.28 24.8,59.68 26,59.68 26,62.48 24.4,62.48 24.4,61.48 14,61.48 14,62.48
PWR_Y
  pour Top (isolate 0.305, no thermals): 44.42,62.48 44.42,59.68 45.62,59.68 45.62,59.28 44.42,59.28 44.42,56.68 42.82,56.68 42.82,58.08 41.22,58.08 41.22,63.88 46.62,63.88 46.62,63.08 53.42,63.08 53.42,64.08 53.82,64.08 53.82,63.08 55.82,63.08 55.82,67.48 60.02,67.48 60.02,71.48 64.12,71.48 64.12,63.78 63.42,63.08 63.42,58.08 59.62,58.08 59.62,56.68 58.02,56.68 58.02,59.28 56.82,59.28 56.82,59.68 58.02,59.68 58.02,62.48 56.42,62.48 56.42,61.48 46.02,61.48 46.02,62.48
PWR_Z
  pour Top (isolate 0.305, no thermals): 76.44,62.48 76.44,59.68 77.64,59.68 77.64,59.28 76.44,59.28 76.44,56.68 74.84,56.68 74.84,58.08 73.24,58.08 73.24,63.88 78.64,63.88 78.64,63.08 85.44,63.08 85.44,64.08 85.84,64.08 85.84,63.08 87.84,63.08 87.84,67.48 92.04,67.48 92.04,71.48 96.14,71.48 96.14,63.78 95.44,63.08 95.44,58.08 91.64,58.08 91.64,56.68 90.04,56.68 90.04,59.28 88.84,59.28 88.84,59.68 90.04,59.68 90.04,62.48 88.44,62.48 88.44,61.48 78.04,61.48 78.04,62.48
PWRIN  (1 unrouted)
RESET
  Top 0.406: JP4.1 JP4.3 47.56,2.63 U$2.3 U$2.4
RESET_GRBL  (3 unrouted)
RESET_SPI
  Top 0.406: U2.29 20.4,16.91 | JP4.2 37.57,5.17 37.4,5 33.1,5 32.6,5.5 32.6,7.2 32,7.8 30.7,7.8 27.6,10.9 21.4,10.9 20.5,11.8 20.5,16.81 20.4,16.91 | 20.4,16.91 22,16.91 | 22,16.91 24.39,16.91 24.6,16.7 C28.1 | R12.1 22.08,16.83 22,16.91
SCK  (via drill 0.5 pad 0.25)
  Top 0.406: IC1.16 v18.4,48.2 | IC2.16 50.42,48.42 v50.4,48.2 | IC4.16 82.44,48.24 v82.4,48.2 | U2.17 9.33,12.9 v1.2,12.9 | EXP2.2 4.33,6.27 3,7.6 v3,9.2
  Bottom 0.406: v82.4,48.2 v50.4,48.2 v18.4,48.2 5.4,48.2 1.2,44 v1.2,12.9 2.7,12.9 3,12.6 v3,9.2
SDO_X
  Top 0.5: IC2.14 48.82,50.68 46.22,48.08 46.22,46.68 45.62,46.08 44.95,46.08 R3.1
SDO_Y
  Top 0.5: IC1.14 16.8,50.68 14.2,48.08 14.2,46.68 13.6,46.08 12.93,46.08 R1.1
SDO_Z
  Top 0.5: IC4.14 80.84,50.68 78.24,48.08 78.24,46.68 77.64,46.08 76.97,46.08 R16.1
STEP_X  (via drill 0.5 pad 0.25)  (1 unrouted)
  Top 0.406: IC1.42 16.8,64.48 16.6,64.68 8.6,64.68 8.4,64.48 v8.4,64.08 | v24,49.88 v24,41.2
  Bottom 0.406: v24,41.2 94.8,41.2 96.4,39.7 96.4,37.2
  Bottom 0.5: v8.4,64.08 8.4,61.48 9.6,60.28 9.6,59.08 12.2,56.48 12.2,53.08 12.6,52.68 21.2,52.68 v24,49.88
STEP_Y  (via drill 0.5 pad 0.25)  (1 unrouted)
  Top 0.406: IC2.42 48.82,64.48 48.62,64.68 40.62,64.68 40.42,64.48 v40.42,64.08 | v56.02,49.88 56.02,43.98 v56.8,43.2
  Bottom 0.406: v56.8,43.2 95.2,43.2 98,40.5 98,37.2
  Bottom 0.5: v40.42,64.08 40.42,61.48 41.62,60.28 41.62,59.08 44.22,56.48 44.22,53.08 44.62,52.68 53.22,52.68 v56.02,49.88
STEP_Z  (via drill 0.5 pad 0.25)  (1 unrouted)
  Top 0.406: IC4.42 80.84,64.48 80.64,64.68 72.64,64.68 72.44,64.48 v72.44,64.08 | v88.04,49.88 88.04,45.26 v88.1,45.2
  Bottom 0.406: v88.1,45.2 95.7,45.2 99.6,41.3 99.6,37.2
  Bottom 0.5: v72.44,64.08 72.44,61.48 73.64,60.28 73.64,59.08 76.24,56.48 76.24,53.08 76.64,52.68 85.24,52.68 v88.04,49.88
STOP_BUTTON  (via drill 0.5 pad 0.25)
  Top 0.406: v16,21.9 16,21.5 15.6,21.1 15.6,20.81 U2.1
  Bottom 0.406: v16,21.9 16,21.5 15.5,21 9.6,21 9.3,20.7 9.3,20.4 9.4,9.8 9.4,8.5 10.3,7.6 12.11,7.6 EXP2.8
V+  (3 unrouted)
VCC  (via drill 0.5 pad 0.25)  (2 unrouted)
  Top 0.406: U2.18 10.8,12.9 v11.61,13.71 U2.6 11.61,22.01 11.8,22.2 13,22.2 13.2,22 13.2,20.89 U2.4 | U1.6 81.71,17.49 | 81.71,17.49 81.9,17.3 83.1,17.3 83.3,17.5 U1.4 | U1.18 80.91,16.69 81.71,17.49 | EXP1.10 36.38,7.12 35.7,7.8 33.3,7.8 32.5,8.6 31.2,8.6 28.1,11.7 22.5,11.7 v22.1,12.1 22.1,13.38 R12.2
  Bottom 0.406: v11.61,13.71 20.59,13.71 v22.1,12.1
VHS
  Top 0.5: IC1.35 22.4,64.36 C11.1
VHS1
  Top 0.5: IC2.35 54.42,64.36 C15.1
VHS2
  Top 0.5: IC4.35 86.44,64.36 C37.1
VMOT  (1 unrouted)
VREG
  Top 0.5: IC1.13 16,51.25 C7.1
VREG1
  Top 0.5: IC2.13 48.02,51.25 C19.1
VREG2
  Top 0.5: IC4.13 80.04,51.25 C41.1